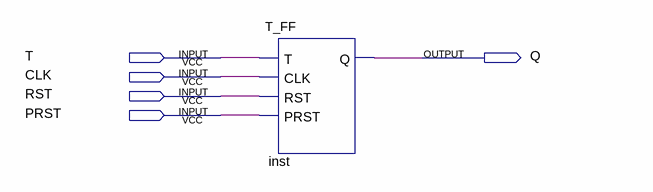
[diagram p0: schematic sheet]
// Quartus schematic lab13_4.bdf as structural Verilog: 1 symbols, 5 pins
module lab13_4 (
  input  T,
  input  CLK,
  input  RST,
  input  PRST,
  output Q
);

  T_FF inst (.T(T), .CLK(CLK), .RST(RST), .PRST(PRST), .Q(Q));
endmodule
